# EAGLE design untitled (EAGLE 8.6.0)
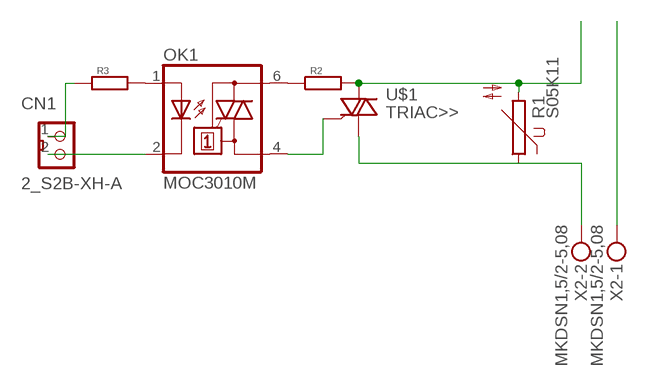
[diagram p0: schematic, sheet 1]

## Parts
CN1  2_S2B-XH-A  [S2B-XH-A]
OK1  MOC3010M  [DIL06]
R1  S05K11  [S05K11]
R2  R-EU>>1/4W(8MM)  [1/4W(8MM)]
R3  R-EU>>1/4W(8MM)  [1/4W(8MM)]
U$1  TRIAC>>  [TO-220_BT]
X2  MKDSN1,5/2-5,08  [MKDSN1,5/2-5,08]

## Nets
N$1: OK1.6(A2) R2.1
N$2: R1.2 R2.2 U$1.2(A2)
N$3: OK1.4(A1) U$1.1(G)
N$4: R1.1 U$1.3(A1) X2.2
N$5: CN1.2 OK1.2(C)
N$6: OK1.1(A) R3.2
N$7: CN1.1 R3.1
N$8: X2.1

## Library data of the parts
CN1 = !con-xh:2_: Wire-to-Board 2.5mm pitch top mount connector Source: http://www.jst-mfg.com/product/pdf/jpn/XH.pdf http://www.jst-mfg.com/product/detail.php?series=277
OK1 = optocoupler:MOC30*M: RANDOM-PHASE OPTOISOLATORS TRIAC DRIVER OUTPUT Source: http://www.fairchildsemi.com MOC3020-M.pdf; MF: FAIRCHILD SEMICONDUCTOR; MPN: MOC3010-M; OC_FARNELL: 1505423; OC_NEWARK: 72K8892
R1 = varistor:S05K11: VARISTOR
R2 R3 = !Resistor(抵抗):R-EU>>: RESISTOR, European symbol
U$1 = !FET_transister_v-reg:TRIAC>>
X2 = !con_phoenix-508(ﾀｰﾐﾅﾙ):MKDSN1,5/2-5,08: MKDSN 1,5/ 2-5,08 Printklemme Nennstrom: 13,5 A Nennspannung: 250 V Rastermaß: 5,08 mm Polzahl: 2 Anschlussart: Schraubanschluss Montage: Löten Anschlussrichtung Leiter/Platine: 0 ° Artikelnummer: 1729128 Source: http://eshop.phoenixcontact.com .. 1729128.pdf; MPN: MKDSN 1,5/2-5.08; OC_FARNELL: 1792903; OC_NEWARK: 30M2397

## Board
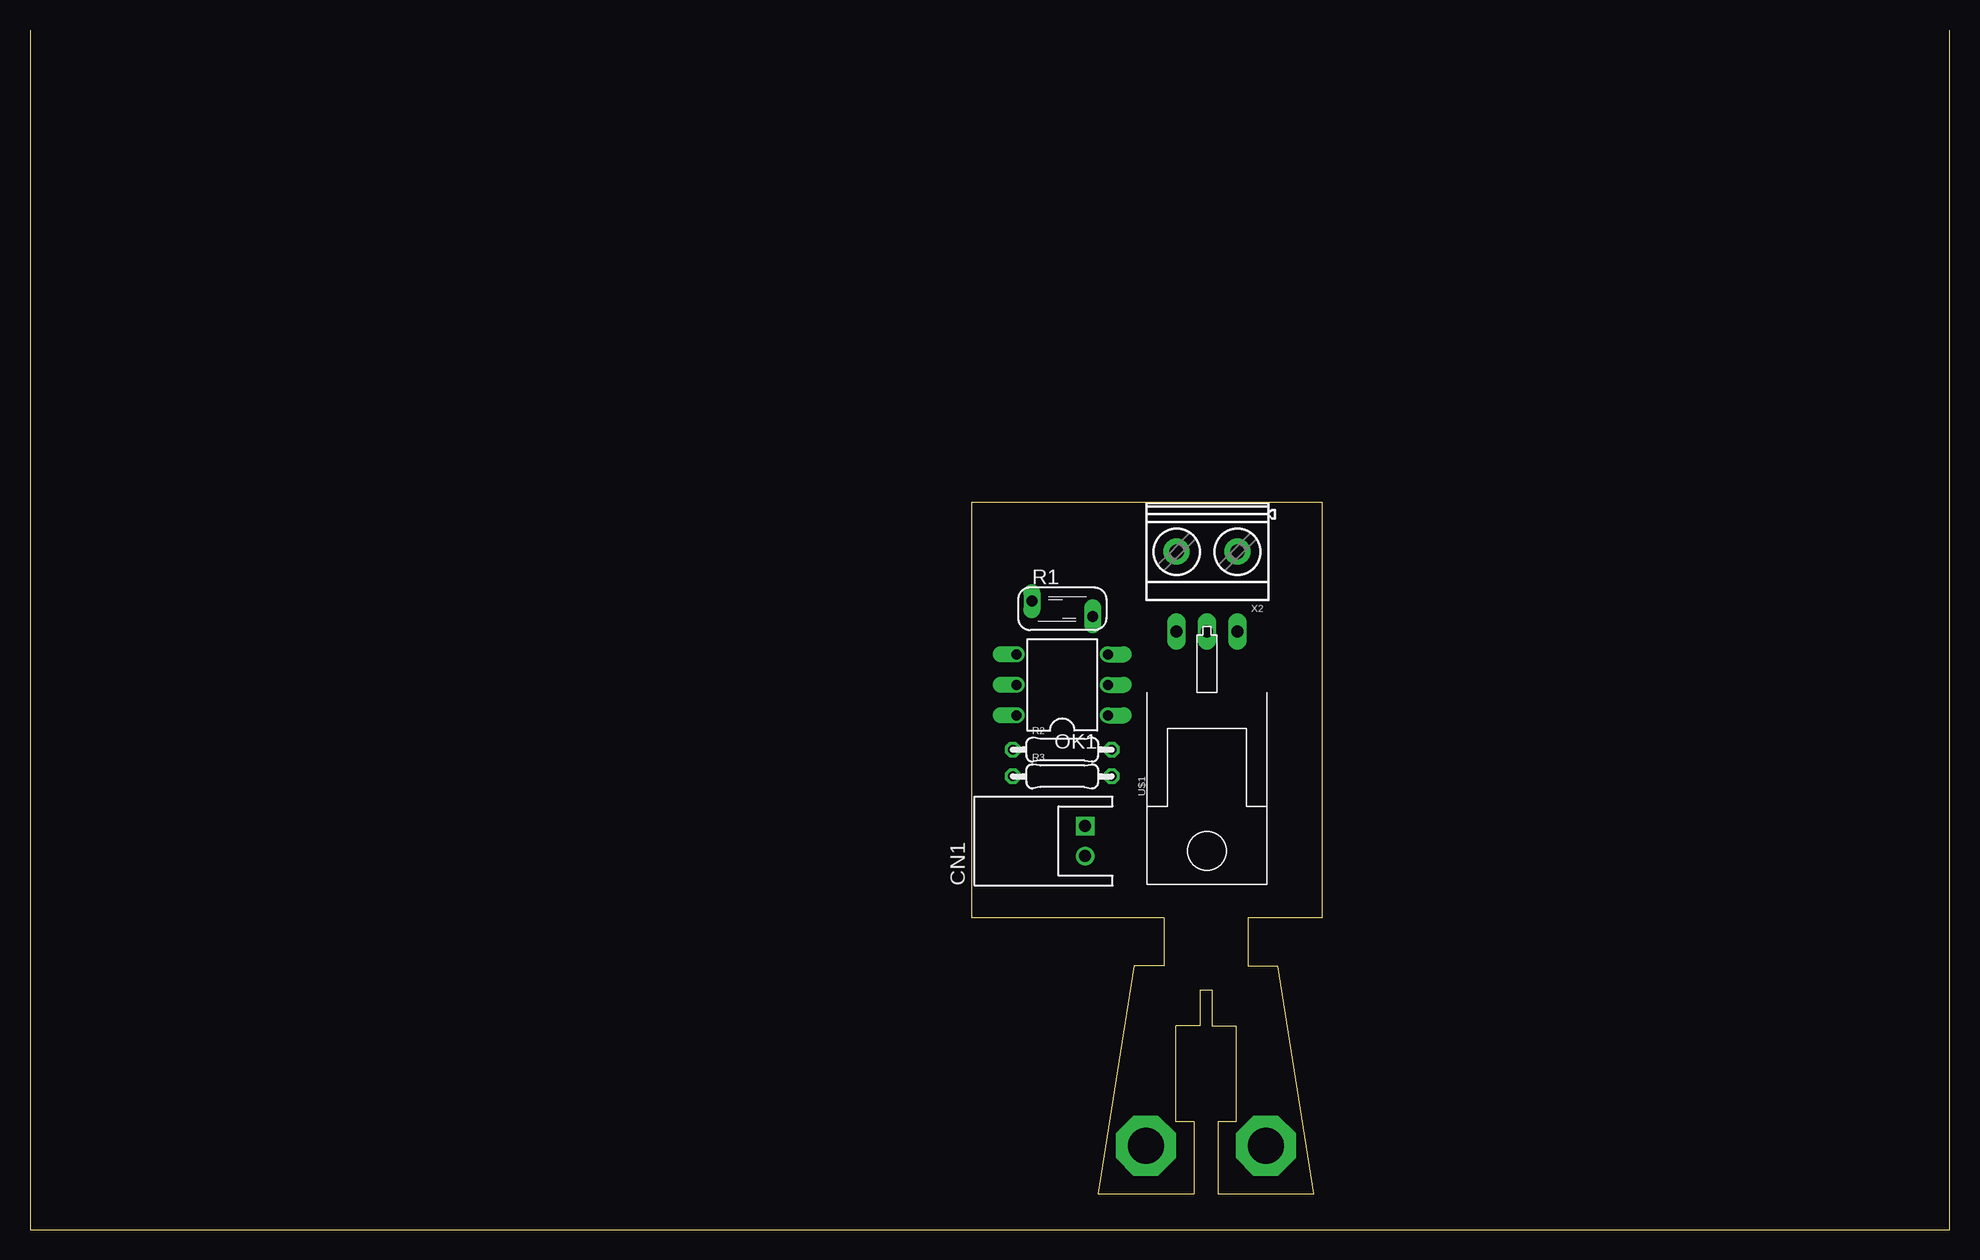
[diagram p1: board, top side]
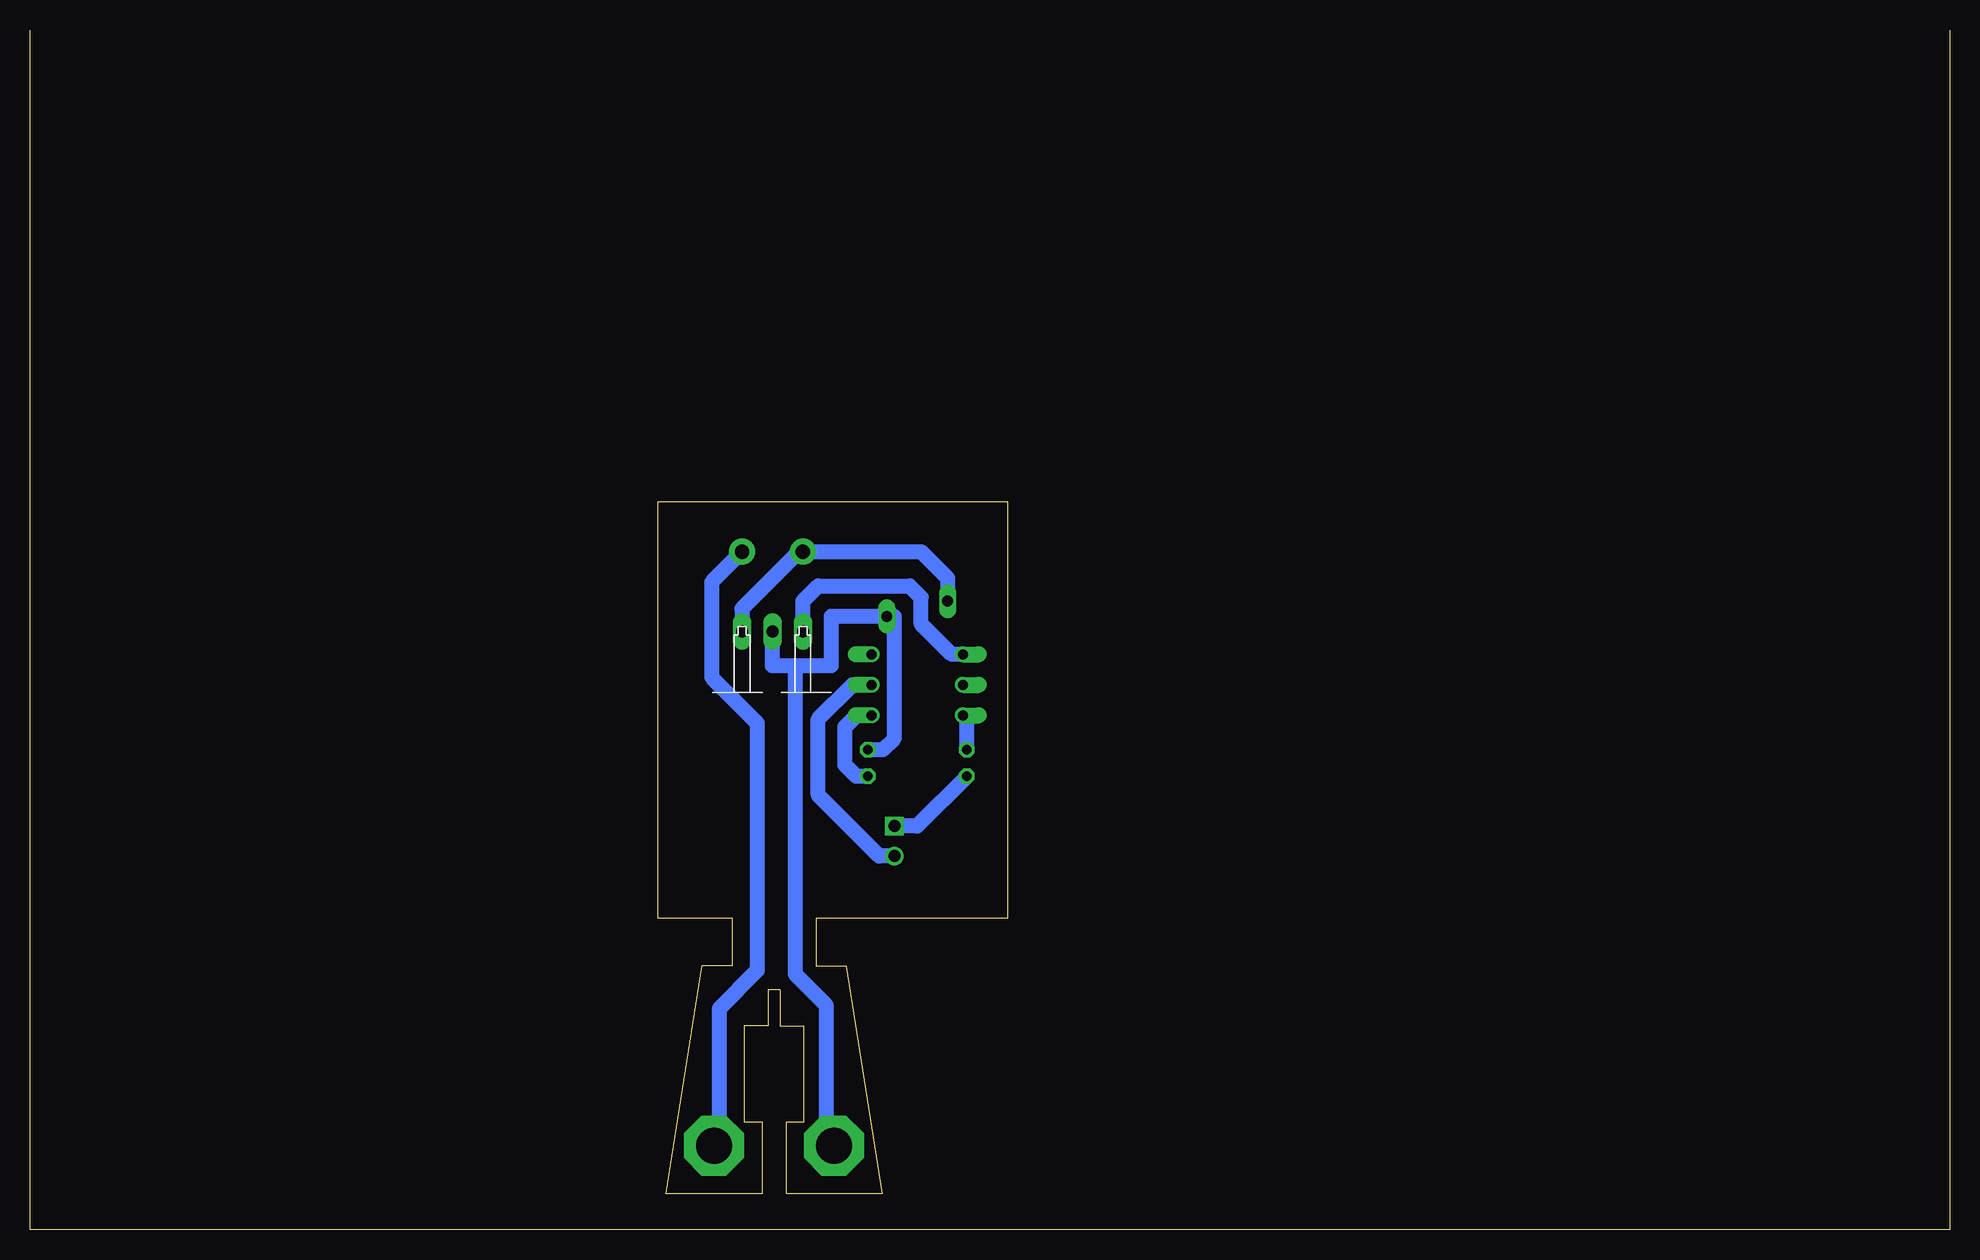
[diagram p2: board, bottom side, seen from below]

Size 160 x 100 mm. Coordinates in mm from the lower left corner, seen from the top.
Outline: 160,100 160,0 0,0 0,100
Outline: 94.5,26 94.5,22 92,22 89,3 97,3 97,9 95.5,9 95.5,17 97.5,17 97.5,20 98.5,20 98.5,17 100.5,17 100.5,9 99,9 99,3 107,3 104,22 101.5,22 101.5,26 107.7,26 107.7,60.66 78.5,60.66 78.5,26 94.5,26
Copper layers (1*16): Top 0.035mm / dielectric 1.5mm / Bottom 0.035mm
Design rules "default": minimum track width 6mil, minimum drill 0.35mm, track to track 6mil, track to pad 6mil, pad to pad 6mil, via to via 6mil, smd to smd 6mil, copper to edge 40mil, drill to drill 6mil, minimum pad ring 10mil, minimum via ring 8mil, stop-mask expansion 4mil, vias tented up to drill 0mil, thermal gap 10mil

### Footprints (pad centres in the part's own frame; a part is rotated, then mirrored left to right if it is on the bottom)
S2B-XH-A = drill 1.016 square: 1 1.25,0 | drill 1.016: 2 -1.25,0
DIL06 = drill 0.813 offset: 1 -2.54,-3.81; 2 0,-3.81; 3 2.54,-3.81; 4 2.54,3.81; 5 0,3.81; 6 -2.54,3.81
S05K11 = drill 0.914 long: 1 -0.635,-2.54; 2 0.635,2.54
1/4W(8MM) = drill 0.8 pad 1.27 octagon: 1 -4.128,0; 2 4.128,0
TO-220_BT = drill 1.016 long: 1 2.54,-5.08; 2 0,-5.08; 3 -2.54,-5.08
MKDSN1,5/2-5,08 = drill 1.2 pad 2.184: 1 -2.54,0; 2 2.54,0

### Placement (x,y rotation side)
CN1  87.95,32.38 90 top
OK1  86.04,45.4 90 top
R1  86.04,51.75 270 top
R2  86.04,40.01 0 top
R3  86.04,37.78 0 top
U$1  98.11,44.77 180 top
X2  98.11,56.52 180 top

### Tracks (layer width: path | path; a pad name or v marks a point on that pad's centre or on a via)
N$1
  Bottom 1.27: R2.1 81.92,42.86 OK1.6
N$2  (via drill 3 pad 5)
  Bottom 1.27: U$1.2 98.11,46.99 96.2,46.99 | R2.2 88.9,40.01 87.95,40.96 87.95,51.12 R1.2 93.21,51.12 93.21,46.99 96.2,46.99 | 96.2,46.99 96.2,21.27 93.66,18.73 93.66,7.66 v93,7
N$3
  Bottom 1.27: U$1.1 95.57,52.39 94.3,53.66 86.68,53.66 85.72,52.7 85.72,50.48 83.19,47.94 OK1.4
N$4
  Bottom 1.27: U$1.3 100.65,51.75 95.89,56.52 X2.2 85.72,56.52 83.5,54.29 R1.1
N$5
  Bottom 1.27: CN1.2 89.22,31.14 94.3,36.22 94.3,42.55 91.44,45.4 OK1.2
N$6
  Bottom 1.27: R3.2 91.12,37.78 92.08,38.73 92.08,41.91 91.12,42.86 OK1.1
N$7
  Bottom 1.27: R3.1 86.06,33.63 CN1.1
N$8  (via drill 3 pad 5)
  Bottom 1.27: X2.1 103.19,53.98 103.19,46.04 99.38,42.23 99.38,21.59 102.55,18.41 102.55,7.45 v103,7